# Altium project XBeeSXPro_Breakout.PrjPcb
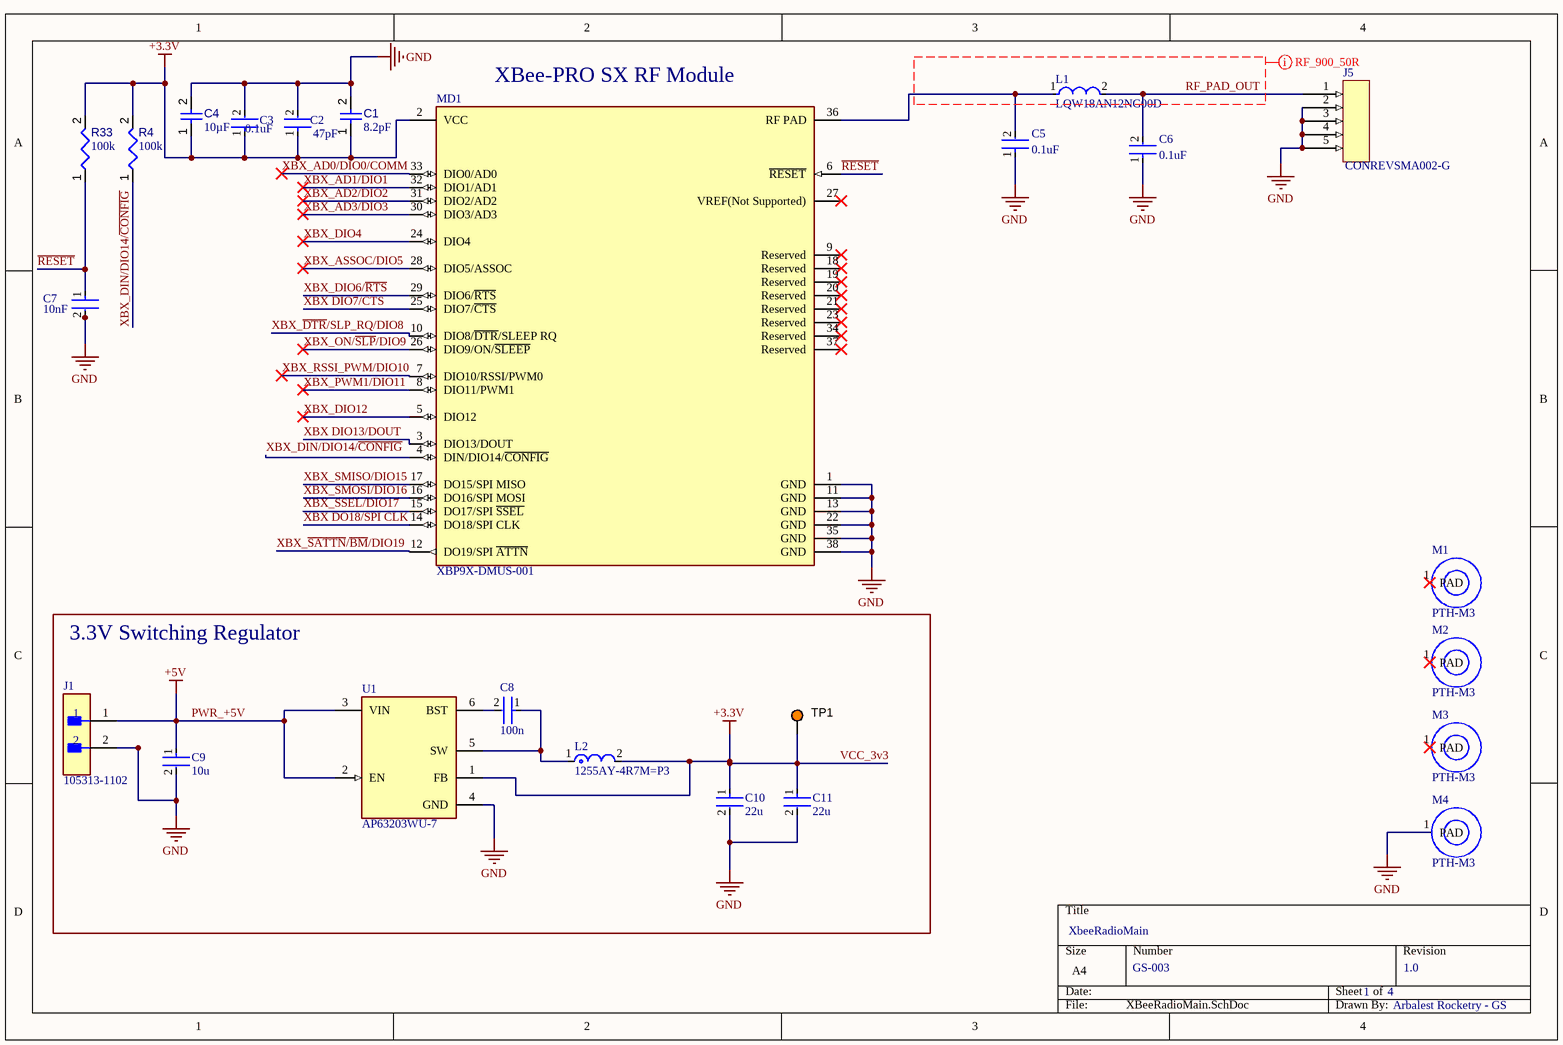
[diagram p0: XBeeRadioMain.SchDoc]
4 sheets, 102 parts. Net scope: global (net labels, ports and power ports of the same name join across sheets).
Board file: MainPCB_XBeeSXPro_Breakout.PcbDoc
Sheets:
  XBeeRadioMain.SchDoc
  FTDI_Chip.SchDoc
  Peripherals.SchDoc
  LED_Indicators.SchDoc

## Sheet XBeeRadioMain.SchDoc
size A4; SheetNumber: 1; SheetTotal: 4

### Parts
C1  value 8.2pF  [CAPC1608X06N]  (hidden comment: 600S8R2BT250XT4K)
C2  47pF  [FP-C0805C470JDGACTU-MFG]
C3  0.1uF  [FP-C0603C-CF-MFG]
C4  value 10µF  [CAPC0805(2012)145_L]  (hidden comment: Capacitor 10µF +/-20% 25V 0805)
C5  0.1uF  [FP-C0603C-CF-MFG]
C6  0.1uF  [FP-C0603C-CF-MFG]
C7  10nF  [FP-C0603C-CF-MFG]
C8  100n  [FP-0603-L_1_6_0_1-W_0_8_0-MFG]
C9  10u  [FP-GRM21B-0_2-e0_2_0_7-IPC_B]
C10  22u  [FP-1210-L_3_2_0_3-W_2_5_0-IPC_A]
C11  22u  [FP-1210-L_3_2_0_3-W_2_5_0-IPC_A]
J1  105313-1102  [FP-105313-1102-MFG]
J5  CONREVSMA002-G  [CONREVSMA002-G-Footprint-1]
L1  LQW18AN12NG00D  [FP-LQW18AN_00-MFG]
L2  1255AY-4R7M=P3  [FP-DG6045C-MFG]
M1  PTH-M3  [PTH-M3-Footprint-1]
M2  PTH-M3  [PTH-M3-Footprint-1]
M3  PTH-M3  [PTH-M3-Footprint-1]
M4  PTH-M3  [PTH-M3-Footprint-1]
MD1  XBP9X-DMUS-001  [FP-XBP9X-DMUS-001-MFG]
R4  value 100k  [RESC2013X70X40ML20T20]  (hidden comment: Resistor 100k +/-1% 0805 125 mW)
R33  value 100k  [RESC2013X70X40ML20T20]  (hidden comment: Resistor 100k +/-1% 0805 125 mW)
TP1  3V3  [KSTN-5003]  (value not drawn)
U1  AP63203WU-7  [FP-TSOT26-MFG]

### Blocks framed on the sheet
3.3V Switching Regulator: C8-C11 J1 L2 TP1 U1

### Nets
GND: C1.2 C2.2 C3.2 C4.2 C5.1 C6.1 C7.2 C9.2 C10.2 C11.2 J1.2 J5.2 J5.3 J5.4 J5.5 M4.1(PAD) MD1.1(GND) MD1.11(GND) MD1.13(GND) MD1.22(GND) MD1.35(GND) MD1.38(GND) U1.4(GND)
PWR_+5V: C9.1 J1.1 U1.2(EN) U1.3(VIN)  [also labelled +5V]
VCC_3v3: C1.1 C2.1 C3.1 C4.1 C10.1 C11.1 L2.2 MD1.2(VCC) R4.2 R33.2 TP1.1 U1.1(FB)  [also labelled +3.3V]
~{RESET}: C7.1 MD1.6(~{RESET}) R33.1
RF_PAD_OUT: C6.2 J5.1 L1.2
XBX DIO7/~{CTS}: MD1.25(DIO7/~{CTS})
XBX DIO13/DOUT: MD1.3(DIO13/DOUT)
XBX DO18/SPI CLK: MD1.14(DO18/SPI_CLK)
XBX_AD0/DIO0/COMM: MD1.33(DIO0/AD0)
XBX_AD1/DIO1: MD1.32(DIO1/AD1)
XBX_AD2/DIO2: MD1.31(DIO2/AD2)
XBX_AD3/DIO3: MD1.30(DIO3/AD3)
XBX_ASSOC/DIO5: MD1.28(DIO5/ASSOC)
XBX_~{DTR}/SLP_RQ/DIO8: MD1.10(DIO8/~{DTR}/SLEEP_RQ)
XBX_DIN/DIO14/~{CONFIG}: MD1.4(DIN/DIO14/~{CONFIG}) R4.1
XBX_DIO4: MD1.24(DIO4)
XBX_DIO6/~{RTS}: MD1.29(DIO6/~{RTS})
XBX_DIO12: MD1.5(DIO12)
XBX_ON/~{SLP}/DIO9: MD1.26(DIO9/ON/~{SLEEP})
XBX_PWM1/DIO11: MD1.8(DIO11/PWM1)
XBX_RSSI_PWM/DIO10: MD1.7(DIO10/RSSI/PWM0)
XBX_~{SATTN}/~{BM}/DIO19: MD1.12(DO19/SPI_~{ATTN})
XBX_~{SSEL}/DIO17: MD1.15(DO17/SPI_~{SSEL})
XBX_SMISO/DIO15: MD1.17(DO15/SPI_MISO)
XBX_SMOSI/DIO16: MD1.16(DO16/SPI_MOSI)
NetC5_2: C5.2 L1.1 MD1.36(RF_PAD)
NetC8_1: C8.1 L2.1 U1.5(SW)
NetC8_2: C8.2 U1.6(BST)

Not connected (* = marked no-connect by the designer): M1 1(PAD)*; M2 1(PAD)*; M3 1(PAD)*; MD1 9(Reserved)* 18(Reserved)* 19(Reserved)* 20(Reserved)* 21(Reserved)* 23(Reserved)* 27(VREF(Not_Supported))* 34(Reserved)* 37(Reserved)*

### Layout directives
net class RF_900_50R: RF_PAD_OUT

### Notes on the sheet
- (near MD1) XBee-PRO SX RF Module
- XbeeRadioMain
- GS-003
- 1
- 4
- 1.0
- Arbalest Rocketry - GS

### Library data of the parts
C1 = CMP-001-00086-1: Ceramic Capacitor, Multilayer, Ceramic, 250V, 1.22% +Tol, 1.22% -Tol, C0G, 30ppm/Cel TC, 0.0000082uF, Surface Mount,...; Max Operating Temperature: 125°C; Mounting Technology: Surface Mount; Min Operating Temperature: -55°C
C2 = CMP-2007-03325-2: CAP CER 47PF 1KV C0G/NP0 0805; Tolerance: 5%; Dissipation Factor: 0.1%; Dielectric: C0G; Voltage Rating (DC): 1.5kV; Dielectric Material: Ceramic; Lead Free: Lead Free; Case/Package: 0805; Construction: Flat; Thickness: 0.055inch; RoHS Compliant: Yes; Length: 0.079inch; Min Operating Temperature: -55°C; Max Operating Temperature: 125°C; Width: 0.049inch; Voltage Rating: 1kV; Radiation Hardening: No; Packaging: Tape and Reel; Termination: SMD/SMT; Series: C; Case Code (Metric): 2012; Mount: Surface Mount; Height: 1.25mm; Capacitance: 47pF; Case Code (Imperial): 0805; Package Quantity: 1; Depth: 1.2mm
C3 C5 C6 = CMP-2006-03061-2: CAP CER 0.1UF 50V X7R 0603; Manufacturer: KEMET; Manufacturer Part Number: C0603C104K5RACTU; Tolerance: 0.1; Temperature Coefficient: 30ppm/°C; Material: Ceramic; Automotive Grade: Grade 1; Value: 0.10 μF; Temperature: -55°C to +125°C; RoHS: TRUE; Temperature Range High: +125°C; Lead Free: Yes; Octopart: https://octopart.com/c0603c104k5ractu-kemet-139244; Digikey Description: CAP CER 0.1UF 50V X7R 0603; Category: Cap; Package: C0603C-CF; ComponentLink2Description: Datasheet; Temperature Range Low: -55°C; Device Class L1: Passive Components; Voltage Rating: 50 V; Automotive: Yes; Device Class L3: Ceramic Capacitors; ComponentLink2URL: https://api.kemet.com/component-edge/download/datasheet/C0603C100J5GACAUTO.pdf; Capacitance: 0.10 μF; Device Class L2: Capacitors; Temperature Characteristic: X7R; Height: 0.87mm
C4 = CMP-001-00079-4: Chip Capacitor, 10µF +/-20%, 25V, 0805, Thickness 1.45 mm; Tolerance: 10%; Max Operating Temperature: 85°C; Case/Package: 0805; Voltage Rating: 25V; Min Operating Temperature: -55°C; Mounting Technology: SMT; Pins: 2
C7 = CMP-2006-03046-3: CAP CER 10000PF 50V X7R 0603; Manufacturer: KEMET; Manufacturer Part Number: C0603C103K5RACTU; Temperature Coefficient: 30ppm/°C; Capacitance: 10,000 pF; Automotive Grade: Grade 1; Material: Ceramic; Value: 10,000 pF; Tolerance: 0.1; Voltage Rating: 50 V; Digikey Description: CAP CER 10000PF 50V X7R 0603; ComponentLink2Description: Datasheet; Mouser Description: Ceramic Capacitor 0.01Uf, 50V, X7R, 10%, 0603, Full Reel; ComponentLink2URL: https://api.kemet.com/component-edge/download/datasheet/C0603C100J5GACAUTO.pdf; Package: C0603C-CF; RoHS: TRUE; Octopart: https://octopart.com/c0603c103k5ractu-kemet-133094; Device Class L1: Passive Components; Temperature Range Low: -55°C; Automotive: Yes; Category: Cap; Lead Free: Yes; Temperature: -55°C to +125°C; Temperature Range High: +125°C; Temperature Characteristic: X7R; Height: 0.87mm; Device Class L3: Ceramic Capacitors; Device Class L2: Capacitors
C8 = CMP-14477-001538-2: None; Voltage Rating: 35V; Tolerance: 10%; Dielectric: X7R; Capacitance: 100nF; Case Code (Imperial): 0603; Case/Package: 0603; Packaging: Tape and Reel; Height: 0.8mm; Termination: SMD/SMT; Ratings: AEC-Q200; Min Operating Temperature: -55°C; Length: 0.063inch; Case Code (Metric): 1608; Lead Free: Lead Free; Halogen Free: Halogen Free; Mount: Surface Mount; Max Operating Temperature: 125°C; Width: 0.031inch; Voltage Rating (DC): 35V; Package Quantity: 1; Thickness: 0.035inch; RoHS Compliant: Yes
C9 = CMP-06035-047417-1: Chip Multilayer Ceramic Capacitors for General Purpose, 0805, 10uF, X7R, 15%, 10%, 25V
C10 C11 = CMP-14477-001688-2: None; Voltage Rating: 25V; Capacitance: 22uF; Tolerance: 20%; Mount: Surface Mount; Case Code (Metric): 3225; Min Operating Temperature: -55°C; Case Code (Imperial): 1210; Case/Package: 1210; Max Operating Temperature: 125°C; Packaging: Tape and Reel; RoHS Compliant: Yes
J1 = CMP-04776-000341-1: CONN HEADER R/A 2POS 2.5MM
J5 = CMP-002-00083-1: RF SMA Connector, Male, Board Mount, Solder Terminal; Manufacturer Lifecycle Status: ACTIVE; Impedance: 50Ω; Number of Positions: 1; China RoHS: Compliant; Packaging: Bulk; Contact Gender: Male
L1 = CMP-06042-001615-1: Wire Wound RF Inductor 12nH ±2% 600mA 0.13Ω 0603 (1608); Test Frequency: 100MHz; Series Resistance: 130mR; Self Resonant Frequency: 6GHz; Current: 500mA; Shielding: Unshielded; Q Factor: 35; Inductance: 12nH; Case Code (Metric): 1608; Case/Package: 0603; Max Operating Temperature: 125°C; Height: 0.8mm; Case Code (Imperial): 0603; Min Operating Temperature: -55°C; Radiation Hardening: No; Width: 0.8mm; Package Quantity: 4000; Number of Pins: 2; Tolerance: 2%; Lead Free: Lead Free; Termination: SMD/SMT; DC Resistance (DCR): 130mR; Packaging: Tape and Reel; Inductance Tolerance: 2%; Current Rating: 600mA; Weight: 0.000106oz; Length: 1.6mm; REACH SVHC: No SVHC; DC Current: 600mA; Depth: 1mm; Military Standard: Not; Max DC Current: 600mA; Resistor Type: Wirewound; Mount: Surface Mount
L2 = CMP-06042-012577-1: Shielded Wirewound Inductor 4.7uH 20% 4000mA 0.0276Ω SMD; Core Material: Ferrite; DC Resistance (DCR): 27.6mR; Test Frequency: 100kHz; Max DC Current: 4A; Current Rating: 4.5A; Packaging: Tape and Reel; Resistor Type: Wirewound; Tolerance: 20%; Height - Seated (Max): 0.177inch; Inductance: 4.7uH; Case/Package: Nonstandard; Shielding: Shielded; Length: 0.248inch; Width: 0.248inch; Mount: Surface Mount
M1-M4 = CMP-00028-00007-1: Mounting hole for M3 screw; Pins: 1; Case/Package: M3; Mounting Technology: THT
MD1 = CMP-84319-000001-1: XBEE PRO MOD TXRX ISM 915MHZ UFL; Manufacturer: Digi International; Min Supply Voltage: 2.4V; Max Supply Voltage: 3.6V; Number Of Adc Channels: 4; Interface: SPI,UART; Receiving Current: 40mA; Bandwidth: 26MHz; Max Frequency: 928MHz; Transmitting Current: 330-900mA; Data Rate: 250kbits/s; Sensitivity: -103dBm; Number Of Gpio: 20; Automotive: No; Lead Free: Yes; Package: 0; Height: 3.556mm; Temperature Range Low: -40°C; Temperature Range High: +85°C; Temperature: -40°C to +85°C; Device Class L1: Integrated Circuits (ICs); Category: UNK; Device Class L3: Transceivers; ComponentLink2URL: https://www.digi.com/resources/documentation/digidocs/pdfs/90001477.pdf; Digikey Description: XBEE PRO MOD TXRX ISM 915MHZ UFL; Octopart: https://octopart.com/xbp9x-dmus-001-digi+international-71530758; Device Class L2: RF Semiconductors and Devices; ComponentLink2Description: Datasheet; RoHS: TRUE; Manufacturer Part Number: XBP9X-DMUS-001
R4 R33 = CMP-009-00024-5: Chip Resistor, 100 KOhm, +/- 1%, 0.125 W, -55 to 155 degC, 0805 (2012 Metric); Power: 125mW; Voltage Rating: 150V; Max Operating Temperature: 155°C; Mounting Technology: SM; RoHS Compliant: True; Tolerance: 1%; Case/Package: 0805; Min Operating Temperature: -55°C; Pins: 2
TP1 = CMP-002-00037-2: Test Point, Orange, Height 4.6 mm, Tail Length 3 mm, 1-Pin THD, RoHS; Manufacturer: Keystone; Colour: Orange; Packaging: Bulk; Package Description: 1-Pin Through Hole Device, Dia 2.54 mm; Pins: 1; Package Reference: 5003; Datasheet Version: Jun-15; Case/Package: 5003; Mounting Technology: TH; Connector Type: TestPoint; Diameter: 2.54mm; Contact Material: Bronze; Datasheet URL: http://keyelco.com/userAssets/file/M65p56.pdf; Manufacturer URL: http://www.keyelco.com/; Package Quantity: 10; Contact Plating: Tin; RoHS Compliant: True
U1 = CMP-12757-000006-1: IC REG BUCK 3.3V 2A TSOT26; Manufacturer: Diodes Inc.; Output Type: Fixed; Min Supply Voltage: 3.8V; Number Of Outputs: 1; Max Junction Temp: +160°C; Nominal Supply Current: 22uA; Standoff Height: 0.01mm; Switching Frequency: 1.1MHz; Max Supply Voltage: 32V; ComponentLink2Description: Datasheet; Device Class L1: Integrated Circuits (ICs); Temperature: to +160°C; Device Class L3: Voltage Regulators - Switching; RoHS: TRUE; Octopart: https://octopart.com/ap63203wu-7-diodes+inc.-98099550; Output Voltage: 3.3V; Lead Free: Yes; ComponentLink2URL: https://www.diodes.com/assets/Datasheets/AP63200-AP63201-AP63203-AP63205.pdf; Digikey Description: IC REG BUCK 3.3V 2A TSOT26; Footprint Url: https://www.diodes.com/assets/Package-Files/TSOT26.pdf; Ambient Temperature Range High: +85°C; Height: 1mm; Automotive: No; Temperature Range High: +160°C; Switching Topology: Buck; Output Current: 2A; Package: TSOT26; Category: IC; Mouser Description: AP63203 Series 3.3 V 2 A SMT Fixed Low IQ Synchronous Buck - TSOT-26; Device Class L2: Power Management ICs; Ambient Temperature Range Low: -40°C; Manufacturer Part Number: AP63203WU-7

## Sheet FTDI_Chip.SchDoc
size A; SheetNumber: 2; SheetTotal: 4
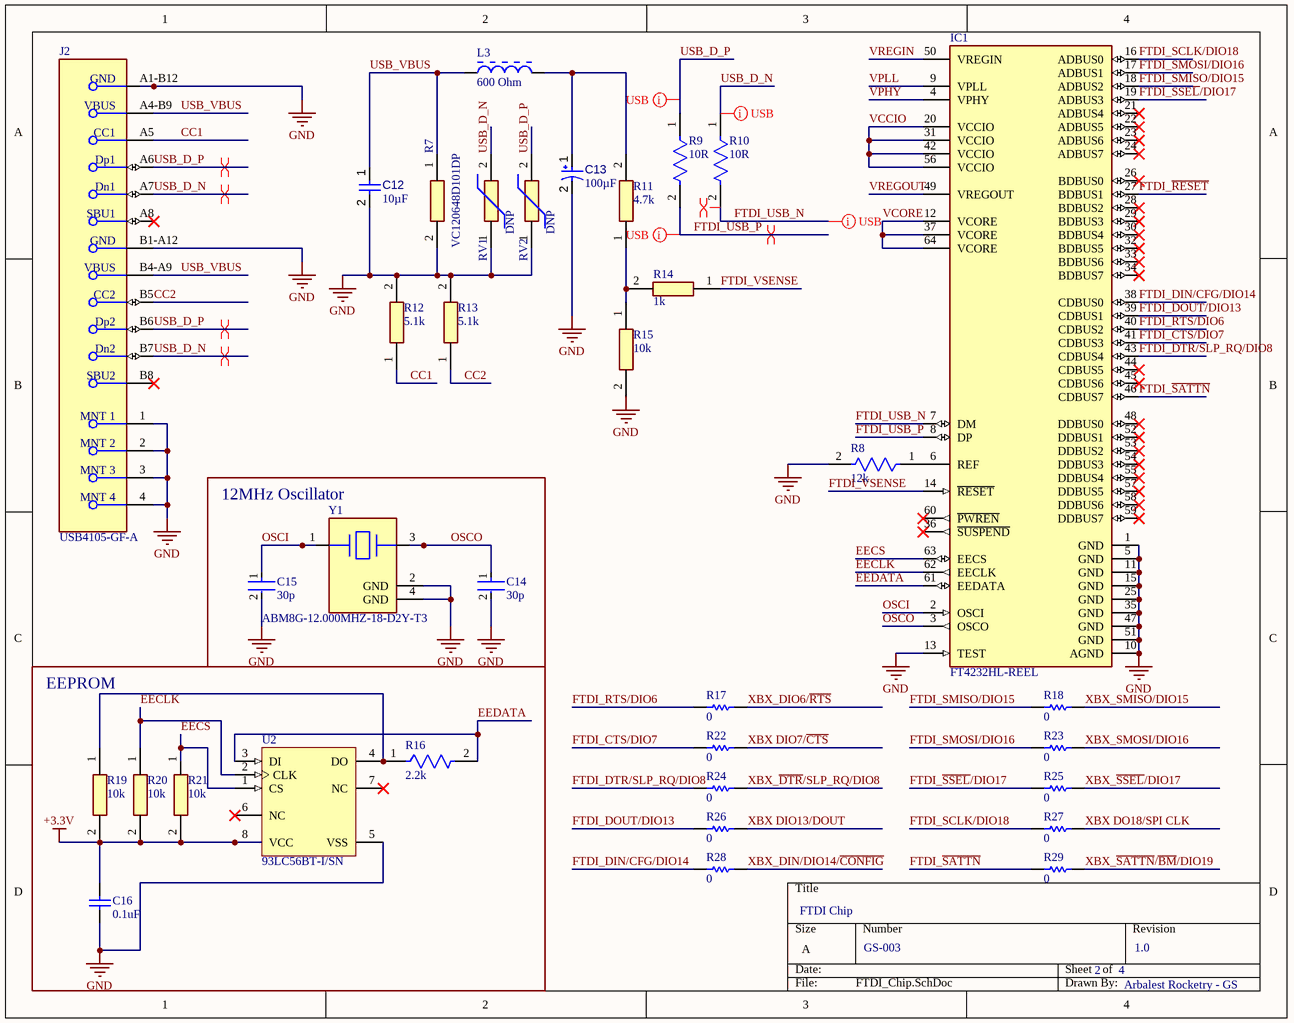
[diagram p1: FTDI_Chip.SchDoc]

### Parts
C12  value 10µF  [CAPC0805(2012)145_L]  (hidden comment: Capacitor 10µF +/-20% 25V 0805)
C13  value 100µF  [CAPPR65-350-1150X800X1250]  (hidden comment: ECA1HM101)
C14  30p  [FP-GCM188-0_1-IPC_B]
C15  30p  [FP-GCM188-0_1-IPC_B]
C16  0.1uF  [CAPC0603(1608)100_L]
IC1  FT4232HL-REEL  [FP-LQFP-64-MFG]
J2  USB4105-GF-A  [FP-USB4105-GF-A-MFG]
L3  600 Ohm  [LIRD-MI0805K601R-10-2_V]
R7  VC120648D101DP  [RESC3216X102N]
R8  12k  [FP-CRCW0402-e3-MFG]
R9  10R  [FP-CRCW0603-e3-MFG]
R10  10R  [FP-CRCW0603-e3-MFG]
R11  4.7k  [RESC1608X55N]
R12  5.1k  [RESC1608X55N]
R13  5.1k  [RESC1608X55N]
R14  1k  [RESC1608X55N]
R15  10k  [RESC1608X55N]
R16  2.2k  [FP-CRCW0603-Pe3-IPC_B]
R17  value 0  [RESC1608X55X25ML10T15]  (hidden comment: Resistor 0R +/- 5% 0603 100 mW)
R18  value 0  [RESC1608X55X25ML10T15]  (hidden comment: Resistor 0R +/- 5% 0603 100 mW)
R19  10k  [RESC1608X55N]
R20  10k  [RESC1608X55N]
R21  10k  [RESC1608X55N]
R22  value 0  [RESC1608X55X25ML10T15]  (hidden comment: Resistor 0R +/- 5% 0603 100 mW)
R23  value 0  [RESC1608X55X25ML10T15]  (hidden comment: Resistor 0R +/- 5% 0603 100 mW)
R24  value 0  [RESC1608X55X25ML10T15]  (hidden comment: Resistor 0R +/- 5% 0603 100 mW)
R25  value 0  [RESC1608X55X25ML10T15]  (hidden comment: Resistor 0R +/- 5% 0603 100 mW)
R26  value 0  [RESC1608X55X25ML10T15]  (hidden comment: Resistor 0R +/- 5% 0603 100 mW)
R27  value 0  [RESC1608X55X25ML10T15]  (hidden comment: Resistor 0R +/- 5% 0603 100 mW)
R28  value 0  [RESC1608X55X25ML10T15]  (hidden comment: Resistor 0R +/- 5% 0603 100 mW)
R29  value 0  [RESC1608X55X25ML10T15]  (hidden comment: Resistor 0R +/- 5% 0603 100 mW)
RV1  DNP  [VARC1608X90N]
RV2  DNP  [VARC1608X90N]
U2  93LC56BT-I/SN  [SOIC-SN8_N]
Y1  ABM8G-12.000MHZ-18-D2Y-T3  [FP-ABM8G-MFG]

### Blocks framed on the sheet
12MHz Oscillator: C14 C15 Y1
EEPROM: C16 R16 R19-R21 U2

### Nets
+3.3V: C16.2 IC1.20(VCCIO) IC1.31(VCCIO) IC1.42(VCCIO) IC1.50(VREGIN) IC1.56(VCCIO) R19.2 R20.2 R21.2 U2.8(VCC)  [also labelled VCCIO, VREGIN]  [project net VCC_3v3]
GND: C12.2 C13.2 C14.2 C15.2 C16.1 IC1.1(GND) IC1.5(GND) IC1.10(AGND) IC1.11(GND) IC1.13(TEST) IC1.15(GND) IC1.25(GND) IC1.35(GND) IC1.47(GND) IC1.51(GND) J2.1(MNT_1) J2.2(MNT_2) J2.3(MNT_3) J2.4(MNT_4) J2.A1-B12(GND) J2.B1-A12(GND) R7.2 R8.2 R12.2 R13.2 R15.2 RV1.1 RV2.1 U2.5(VSS) Y1.2(GND) Y1.4(GND)
CC1: J2.A5(CC1) R12.1
CC2: J2.B5(CC2) R13.1
EECLK: IC1.62(EECLK) R20.1 U2.2(CLK)
EECS: IC1.63(EECS) R21.1 U2.1(CS)
EEDATA: IC1.61(EEDATA) R16.2 U2.3(DI)
FTDI_CTS/DIO7: IC1.41(CDBUS3) R22.1
FTDI_DIN/CFG/DIO14: IC1.38(CDBUS0) R28.1
FTDI_DOUT/DIO13: IC1.39(CDBUS1) R26.1
FTDI_DTR/SLP_RQ/DIO8: IC1.43(CDBUS4) R24.1
FTDI_~{RESET}: IC1.27(BDBUS1)
FTDI_RTS/DIO6: IC1.40(CDBUS2) R17.1
FTDI_~{SATTN}: IC1.46(CDBUS7) R29.1
FTDI_~{SSEL}/DIO17: IC1.19(ADBUS3) R25.1
FTDI_SCLK/DIO18: IC1.16(ADBUS0) R27.1
FTDI_SMISO/DIO15: IC1.18(ADBUS2) R18.1
FTDI_SMOSI/DIO16: IC1.17(ADBUS1) R23.1
FTDI_USB_N: IC1.7(DM) R10.2
FTDI_USB_P: IC1.8(DP) R9.2
FTDI_VSENSE: IC1.14(~{RESET}) R14.1
OSCI: C15.1 IC1.2(OSCI) Y1.1
OSCO: C14.1 IC1.3(OSCO) Y1.3
USB_D_N: J2.A7(Dn1) J2.B7(Dn2) R10.1 RV1.2
USB_D_P: J2.A6(Dp1) J2.B6(Dp2) R9.1 RV2.2
USB_VBUS: C12.1 J2.A4-B9(VBUS) J2.B4-A9(VBUS) L3.1 R7.1
VCORE: IC1.12(VCORE) IC1.37(VCORE) IC1.49(VREGOUT) IC1.64(VCORE)  [also labelled VREGOUT]  [project net FTDI_1V8]
VPHY: IC1.4(VPHY)
VPLL: IC1.9(VPLL)
XBX DIO7/~{CTS}: R22.2
XBX DIO13/DOUT: R26.2
XBX DO18/SPI CLK: R27.2
XBX_~{DTR}/SLP_RQ/DIO8: R24.2
XBX_DIN/DIO14/~{CONFIG}: R28.2
XBX_DIO6/~{RTS}: R17.2
XBX_~{SATTN}/~{BM}/DIO19: R29.2
XBX_~{SSEL}/DIO17: R25.2
XBX_SMISO/DIO15: R18.2
XBX_SMOSI/DIO16: R23.2
NetC13_1: C13.1 L3.2 R11.2
NetIC1_6: IC1.6(REF) R8.1
NetR11_1: R11.1 R14.2 R15.1
NetR16_1: R16.1 R19.1 U2.4(DO)

Not connected (* = marked no-connect by the designer): IC1 21(ADBUS4)* 22(ADBUS5)* 23(ADBUS6)* 24(ADBUS7)* 26(BDBUS0)* 28(BDBUS2)* 29(BDBUS3)* 30(BDBUS4)* 32(BDBUS5)* 33(BDBUS6)* 34(BDBUS7)* 36(~{SUSPEND})* 44(CDBUS5)* 45(CDBUS6)* 48(DDBUS0)* 52(DDBUS1)* 53(DDBUS2)* 54(DDBUS3)* 55(DDBUS4)* 57(DDBUS5)* 58(DDBUS6)* 59(DDBUS7)* 60(~{PWREN})*; J2 A8(SBU1)* B8(SBU2)*; U2 6(NC)* 7(NC)*

### Layout directives
differential pair: FTDI_USB_N, FTDI_USB_P, USB_D_N, USB_D_P
net class USB: USB_D_N
mark named USB: FTDI_USB_N, FTDI_USB_P, USB_D_P

### Notes on the sheet
- FTDI Chip
- GS-003
- 2
- 4
- 1.0
- Arbalest Rocketry - GS

### Library data of the parts
C12 = CMP-001-00079-4: as C4 on sheet XBeeRadioMain; Max Operating Temperature: 85°C; Case/Package: 0805; Voltage Rating: 25V; Min Operating Temperature: -55°C; Mounting Technology: SMT; Pins: 2
C13 = CMP-001-00026-7: Aluminum Electrolytic Capacitor, 100 uF, +/- 20%, 50 V, -40 to 85 degC, 2-Pin THD, RoHS, Bulk; Manufacturer: Panasonic; Voltage Rating: 50V; Ripple Current: 250mA; Datasheet URL: https://industrial.panasonic.com/cdbs/www-data/pdf/RDF0000/ABA0000C1218.pdf; Lead Pitch: 3.5mm; Mounting Technology: TH; Package Description: 2-Pin Radial Lead, Dia 8 mm, Height 12.5 mm; Diameter: 8mm; Ripple Current (AC): 250mA; Manufacturer URL: http://www.panasonic.com/; Capacitor Type: Electrolytic; Max Operating Temperature: 85°C; Pins: 2; Min Operating Temperature: -40°C; Tolerance: 20%; Case/Package: Radial; Packaging: Bulk; Package Quantity: 200; Package Reference: CAPPR65-350-1150X800X1250; RoHS Compliant: True; Datasheet Version: Rev. 05, 10/2016
C14 C15 = CMP-06035-014609-1: Ceramic Capacitor for Automotive 30pF  ±1% 100VDC C0G 0603 Paper T/R
C16 = CMP-1035-02591-1: CAP 100nF 50V ±5% 0603 (1608 Metric) Thickness 1mm SMD; Tolerance: Â±5%; Case-Metric: 1608; Case-EIA: 0603; Rated Voltage: 50 V; Max Thickness: 1 mm; Technology: SMT; Value: 100nF
IC1 = CMP-0078-00021-4: IC USB HS QUAD UART/SYNC 64-LQFP; Manufacturer: FTDI; Number Of Ports: 1; Max Supply Voltage: 3.6V; Data Rate: 480Mbits/s; Nominal Supply Current: 70mA; Usb Standard: USB 2.0; Interface: I2C,SPI,UART,USB,Other; Min Supply Voltage: 3V; Standoff Height: 0.05mm; Ipc Land Pattern Name: QFP50P1200X1200X160-64; ComponentLink2Description: Datasheet; Temperature Range Low: -40°C; Footprint Url: https://www.ftdichip.com/Support/Documents/TechnicalNotes/TN_166%20FTDI%20Example%20IC%20PCB%20Footprints.pdf; Manufacturer Part Number: FT4232HL-REEL; Height: 1.6mm; ComponentLink2URL: https://www.ftdichip.com/Support/Documents/DataSheets/ICs/DS_FT4232H.pdf; Device Class L2: Interface ICs; Ambient Temperature Range Low: -40°C; RoHS: TRUE; Package: LQFP-64; Temperature Range High: +85°C; Digikey Description: IC USB HS QUAD UART/SYNC 64-LQFP; Temperature: -40°C to +85°C; Lead Free: Yes; Device Class L1: Integrated Circuits (ICs); Category: IC; Automotive: No; Ambient Temperature Range High: +85°C; Octopart: https://octopart.com/ft4232hl-reel-ftdi-19172127; Device Class L3: USB Interface ICs
J2 = CMP-245163-000001-1: CONN RCPT USB2.0 TYPEC 5A; Manufacturer: GCT; Voltage Rating: 20V; Is Female: yes; Current Rating: 5/6.25/1.25/0.25A; Number Of Contacts: 16; Conn Orientation: Right Angle; Device Class L1: Connectors; Category: Conn; Lead Free: Yes; RoHS: TRUE; Temperature Range High: +85°C; Digikey Description: CONN RCPT USB2.0 TYPEC 5A; Device Class L3: unset; ComponentLink2Description: Datasheet; Manufacturer Part Number: USB4105-GF-A; Package: 0; Usb Standard: USB 2.0; Device Class L2: USB Connectors; Automotive: No; Temperature Range Low: -40°C; Height: 3.46mm; Temperature: -40°C to +85°C; Contact Material: Gold,Nickel; ComponentLink2URL: https://gct.co/files/drawings/usb4105.pdf; Octopart: https://octopart.com/usb4105-gf-a-gct-106627878
L3 = CMP-2000-05196-1: Chip Bead for Power Filtering, 1500 mA, 600 Ohm, -40 to 125 degC, 0805 (2012 Metric), RoHS, Tape and Reel; Manufacturer: Laird; Filter Type: PowerLine; Current Rating (Max): 1.5A; Catalog Drawings: (HI,HZ,LI,MI)0805Series_1.10mmMax.Height; Impedance @ Frequency: 600Ohm@100MHz; Number of Lines: 1; DC Resistance (DCR) (Max): 100mOhm; Other Names: 240-2390-1; Kits: 240-2227-ND-KITEMIFERRITEBEADCHIPSMD; Online Catalog: MISeries; Standard Package: 1; Datasheet Version: Rev. A, 01/2004; Height (Max): 0.043"(1.10mm); Category: Filters; Operating Temperature: -40degC~125degC; Package Description: 2-Pin Surface Mount Device, Body 2 x 1.25 mm; Package / Case: 0805(2012Metric); Package Reference: MI0805K601R-10-2; Packaging: CutTape(CT); Ratings: -; Mounting Type: SurfaceMount; Datasheet URL: https://datasheet.ciiva.com/3082/mi0805k601r-10-a-vp-3082219.pdf; Size / Dimension: 0.079"Lx0.049"W(2.00mmx1.25mm); Family: FerriteBeadsandChips; Manufacturer URL: https://www.lairdtech.com; Series: MI
R7 = VC120648D101DP: Varistor; Manufacturer_Name: Kyocera AVX; Datasheet Link: https://componentsearchengine.com/Datasheets/2/VC120648D101DP.pdf; Height: 1.02mm; Manufacturer_Part_Number: VC120648D101DP; Mouser Part Number: 581-VC120648D101DP; Mouser Price/Stock: https://www.mouser.com/Search/Refine.aspx?Keyword=581-VC120648D101DP; Arrow Part Number: VC120648D101DP; Arrow Price/Stock: https://www.arrow.com/en/products/vc120648d101dp/avx?region=europe
R8 = CMP-02407-010136-1: RES Thick Film, 12kΩ, 1%, 0.063W, 100ppm/°C, 0402; Max Power Dissipation: 63mW; Resistance: 12kR; Max Operating Temperature: 155°C; Temperature Coefficient: 100ppm/°C; Composition: Thick Film; Packaging: Tape and Reel; Min Operating Temperature: -55°C; Length: 0.039inch; Height: 0.016inch; Number of Terminations: 2; Features: Automotive AEC-Q200; Lead Free: Lead Free; Package Quantity: 50000; Case/Package: 0402; Tolerance: 1%; Width: 0.02inch
R9 R10 = CMP-02407-006896-1: RES Thick Film, 10Ω, 1%, 0.1W, 100ppm/°C, 0603; Power Rating: 100mW; Lead Free: Lead Free; Case/Package: 0603; Tolerance: 1%; Resistance: 10R
R11 = CR0603-JW-472ELF: Resistor; Manufacturer_Name: Bourns; Datasheet Link: https://www.bourns.com/pdfs/chpreztr.pdf; Height: 0.55mm; Manufacturer_Part_Number: CR0603-JW-472ELF; Mouser Part Number: 652-CR0603-JW-472ELF; Mouser Price/Stock: https://www.mouser.co.uk/ProductDetail/Bourns/CR0603-JW-472ELF?qs=YYkh393lUtir45oxsbM4ug%3D%3D; Arrow Part Number: CR0603-JW-472ELF; Arrow Price/Stock: https://www.arrow.com/en/products/cr0603-jw-472elf/bourns?region=nac
R12 R13 = CR0603-FX-5101ELF: Resistor; Manufacturer_Name: Bourns; Datasheet Link: https://www.bourns.com/pdfs/chpreztr.pdf; Height: 0.55mm; Manufacturer_Part_Number: CR0603-FX-5101ELF; Mouser Part Number: 652-CR0603FX-5101ELF; Mouser Price/Stock: https://www.mouser.co.uk/ProductDetail/Bourns/CR0603-FX-5101ELF?qs=0nF2VnfAjXkzZl7D0jRjmQ%3D%3D; Arrow Part Number: CR0603-FX-5101ELF; Arrow Price/Stock: https://www.arrow.com/en/products/cr0603-fx-5101elf/bourns?utm_currency=USD&region=nac
R14 = CR0603-JW-102ELF: Resistor; Manufacturer_Name: Bourns; Datasheet Link: https://www.bourns.com/pdfs/chpreztr.pdf; Height: 0.55mm; Manufacturer_Part_Number: CR0603-JW-102ELF; Mouser Part Number: 652-CR0603-JW-102ELF; Mouser Price/Stock: https://www.mouser.co.uk/ProductDetail/Bourns/CR0603-JW-102ELF?qs=rcPhh2wube3o3zlmFZCUPg%3D%3D; Arrow Part Number: CR0603-JW-102ELF; Arrow Price/Stock: https://www.arrow.com/en/products/cr0603-jw-102elf/bourns?region=nac
R15 R19-R21 = CR0603-FX-1002ELF: Resistor; Manufacturer_Name: Bourns; Datasheet Link: https://www.bourns.com/pdfs/chpreztr.pdf; Height: 0.55mm; Manufacturer_Part_Number: CR0603-FX-1002ELF; Mouser Part Number: 652-CR0603FX-1002ELF; Mouser Price/Stock: https://www.mouser.co.uk/ProductDetail/Bourns/CR0603-FX-1002ELF?qs=K5ddiUFZPT6XHG0dQH96QA%3D%3D; Arrow Part Number: CR0603-FX-1002ELF; Arrow Price/Stock: https://www.arrow.com/en/products/cr0603-fx-1002elf/bourns?utm_currency=USD&region=europe
R16 = CMP-03613-000087-1: RES Thick Film, 2.2kΩ, 1%, 0.1W, 50ppm/°C, 0603; Resistance: 2.2kR; Max Power Dissipation: 100mW; Package Quantity: 5000; Military Standard: Not; Min Operating Temperature: -55°C; Tolerance: 1%; Number of Terminations: 2; Features: Automotive AEC-Q200; Temperature Coefficient: 50ppm/°C; Max Operating Temperature: 155°C; RoHS Compliant: Yes; Height: 0.02inch; Case/Package: 0603; Width: 0.033inch; Series: CRCW-P; Depth: 0.85mm; Resistor Type: Thick Film; Length: 0.061inch; Packaging: Tape and Reel
R17 R18 R22-R29 = CMP-009-00006-5: Chip Resistor, 0 Ohm, 0.1 W, -55 to 155 degC, 0603 (1608 Metric); Power: 100mW; Voltage Rating: 50V; Max Operating Temperature: 155°C; RoHS Compliant: True; Mounting Technology: SM; Case/Package: 0603; Min Operating Temperature: -55°C; Tolerance: 5%; Pins: 2
RV1 RV2 = USB0001DP: Varistor; Manufacturer_Name: Kyocera AVX; Datasheet Link: https://mouser.componentsearchengine.com/Datasheets/1/USB0001DP.pdf; Height: 0.9mm; Manufacturer_Part_Number: USB0001DP; Mouser Part Number: 581-USB0001DP; Mouser Price/Stock: https://www.mouser.co.uk/ProductDetail/KYOCERA-AVX/USB0001DP?qs=uJhfjP5Xp6wpAsZ0ctZLuw%3D%3D; Arrow Part Number: USB0001DP; Arrow Price/Stock: https://www.arrow.com/en/products/usb0001dp/avx?utm_currency=USD&region=nac
U2 = CMP-0162-00090-1: 2K, 128x16-bit, 2.5V Microwire Serial EEPROM, 8-Pin SOIC 150mil, Industrial Temperature, Tape and Reel; PackageDescription: 8-Lead Plastic Small Outline (SN) - Narrow, 3.90mm Body [SOIC]; DatasheetVersion: revF, May-2008; Code_IPC: SOIC127P600-8; Code_JEDEC: MS-012; PackageVersion: revBB, Aug-2009; PackageReference: SOIC-SN8
Y1 = CMP-27762-015318-1: Crystal 12MHz ±20ppm (Tol) ±30ppm (Stability) 18pF FUND 120Ω 4-Pin SMD T/R; Series Resistance: 120R; Load Capacitance: 18pF; Mount: Surface Mount; Length: 0.126inch; Package Quantity: 3000; Termination: SMD/SMT; Width: 2.5mm; Max Operating Temperature: 85°C; ESR (Equivalent Series Resistance): 120R; Packaging: Tape and Reel; Operating Frequency: 12 MHz; Frequency Tolerance: 20ppm; Frequency: 12MHz; Lead Free: Lead Free; Case/Package: SMD/SMT; Height: 0.039inch; Tolerance: 20ppm; Series: ABM8G; Frequency Stability: 30ppm; Min Operating Temperature: -40°C; Number of Pins: 4

## Sheet Peripherals.SchDoc
size A; SheetNumber: 3; SheetTotal: 4
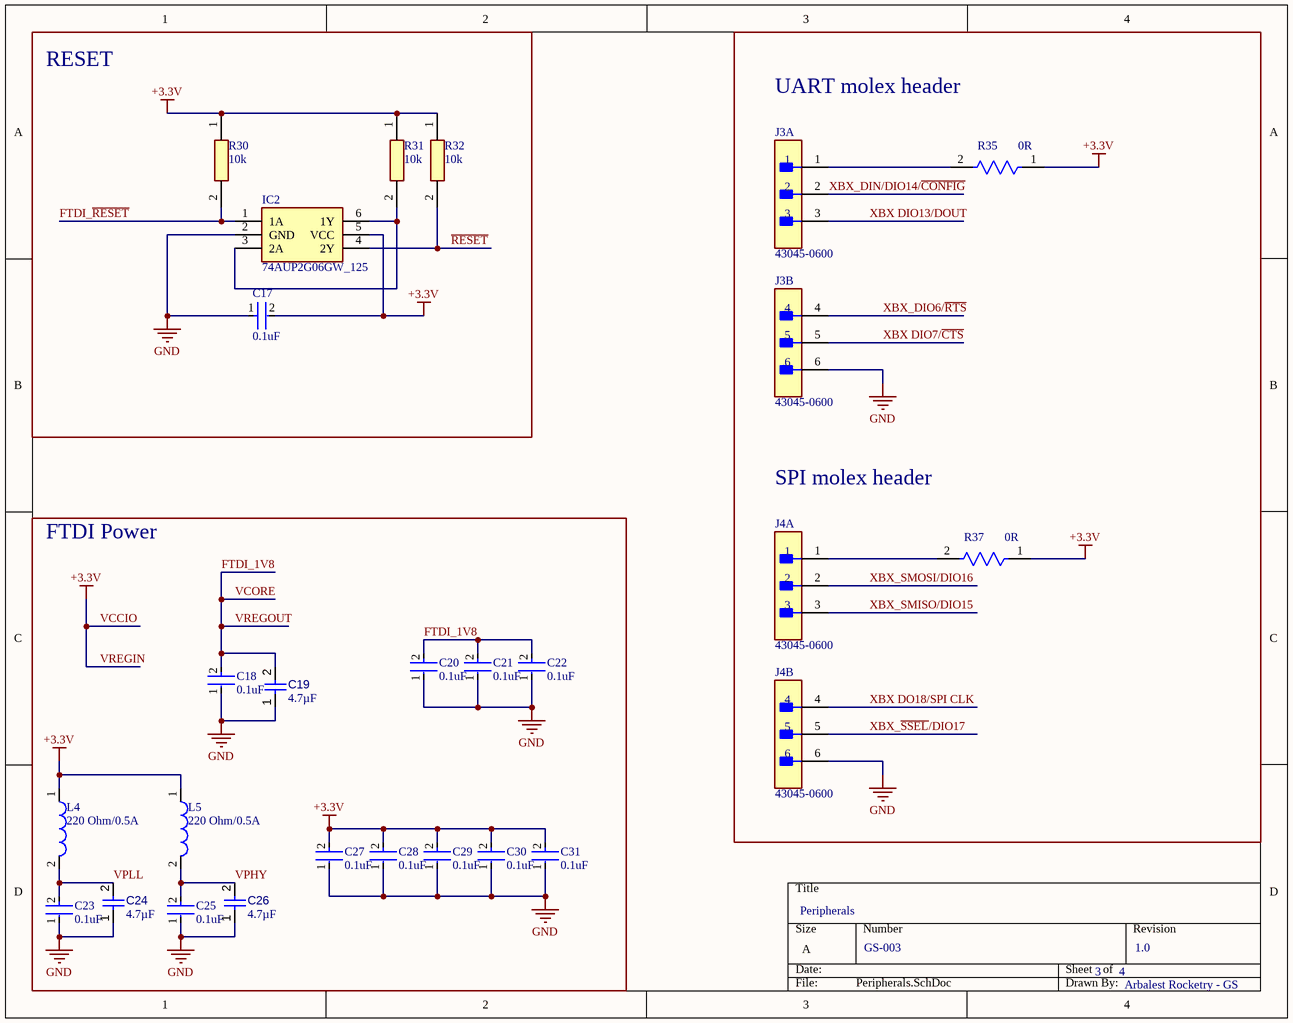
[diagram p2: Peripherals.SchDoc]

### Parts
C17  0.1uF  [FP-CGA3E-0_3-0_1-IPC_A]
C18  0.1uF  [FP-GCJ188-0_2-IPC_C]
C19  value 4.7µF  [CAPC0603(1608)100_L]  (hidden comment: Capacitor 4.7µF +/-20% 10V 0603)
C20  0.1uF  [FP-GCJ188-0_2-IPC_C]
C21  0.1uF  [FP-GCJ188-0_2-IPC_C]
C22  0.1uF  [FP-GCJ188-0_2-IPC_C]
C23  0.1uF  [FP-GCJ188-0_2-IPC_C]
C24  value 4.7µF  [CAPC0603(1608)100_L]  (hidden comment: Capacitor 4.7µF +/-20% 10V 0603)
C25  0.1uF  [FP-GCJ188-0_2-IPC_C]
C26  value 4.7µF  [CAPC0603(1608)100_L]  (hidden comment: Capacitor 4.7µF +/-20% 10V 0603)
C27  0.1uF  [FP-GCJ188-0_2-IPC_C]
C28  0.1uF  [FP-GCJ188-0_2-IPC_C]
C29  0.1uF  [FP-GCJ188-0_2-IPC_C]
C30  0.1uF  [FP-GCJ188-0_2-IPC_C]
C31  0.1uF  [FP-GCJ188-0_2-IPC_C]
IC2  74AUP2G06GW_125  [SOT65P210X110-6N]
J3  43045-0600  [FP-0430450600-MFG]  (parts A,B of 2)
J4  43045-0600  [FP-0430450600-MFG]  (parts A,B of 2)
L4  220 Ohm/0.5A  [SMD-0603]
L5  220 Ohm/0.5A  [SMD-0603]
R30  10k  [RESC1608X55N]
R31  10k  [RESC1608X55N]
R32  10k  [RESC1608X55N]
R35  0R  [FP-ERJ-3GEY0R00V-MFG]
R37  0R  [FP-ERJ-3GEY0R00V-MFG]

### Blocks framed on the sheet
RESET: C17 IC2 R30-R32
FTDI Power: C18-C31 L4 L5

### Nets
+3.3V: C17.2 C27.2 C28.2 C29.2 C30.2 C31.2 IC2.5(VCC) L4.1 L5.1 R30.1 R31.1 R32.1 R35.1 R37.1  [also labelled VCCIO, VREGIN]  [project net VCC_3v3]
GND: C17.1 C18.1 C19.1 C20.1 C21.1 C22.1 C23.1 C24.1 C25.1 C26.1 C27.1 C28.1 C29.1 C30.1 C31.1 IC2.2(GND) J3.6 J4.6
FTDI_1V8: C18.2 C19.2 C20.2 C21.2 C22.2  [also labelled VCORE, VREGOUT]
FTDI_~{RESET}: IC2.1(1A) R30.2
~{RESET}: IC2.4(2Y) R32.2
VPHY: C25.2 C26.2 L5.2
VPLL: C23.2 C24.2 L4.2
XBX DIO7/~{CTS}: J3.5
XBX DIO13/DOUT: J3.3
XBX DO18/SPI CLK: J4.4
XBX_DIN/DIO14/~{CONFIG}: J3.2
XBX_DIO6/~{RTS}: J3.4
XBX_~{SSEL}/DIO17: J4.5
XBX_SMISO/DIO15: J4.3
XBX_SMOSI/DIO16: J4.2
NetIC2_3: IC2.3(2A) IC2.6(1Y) R31.2
NetJ3_1: J3.1 R35.2
NetJ4_1: J4.1 R37.2

### Notes on the sheet
- UART molex header
- SPI molex header
- Peripherals
- GS-003
- 3
- 4
- 1.0
- Arbalest Rocketry - GS

### Library data of the parts
C17 = CMP-08246-001708-1: Cap Ceramic 100nF 50V X7R 20% Pad SMD 0603 +125°C Automotive T/R; Voltage Rating: 50V; Width: 0.031inch; Height: 0.8mm; Capacitance: 100nF; Case Code (Metric): 1608; Packaging: Tape and Reel; Mount: Surface Mount; Weight: 7.1E-05oz; Max Operating Temperature: 125°C; Min Operating Temperature: -55°C; Voltage Rating (DC): 50V; Ratings: AEC-Q200; Dielectric: X7R; Case Code (Imperial): 0603; Package Quantity: 4000; Length: 0.063inch; Tolerance: 20%; Thickness: 0.031inch; Case/Package: 0603
C18 C20-C23 C25 C27-C31 = CMP-06035-054388-1: Cap Ceramic 0.1uF 50V X8R 10% Pad SMD 0603 Soft Termination +150°C Automotive T/R
C19 C24 C26 = CMP-001-00076-4: Chip Capacitor, 4.7µF +/-20%, 10V, 0603, Thickness 1 mm; Tolerance: 10%; Mounting Technology: SMT; Case/Package: 0603; Pins: 2; Min Operating Temperature: -55°C; Max Operating Temperature: 85°C; Voltage Rating: 10V
IC2 = CMP-159-000000-1: 74AUP2G06 - Low-power dual inverter with open-drain output@en-us; Manufacturer_Name: Nexperia; Manufacturer_Part_Number: 74AUP2G06GW,125; Geometry.Height: 1.1mm; Source: 74AUP2G06GW_125.SchLib; Mouser Part Number: 771-74AUP2G06GW125; Mouser Price/Stock: https://www.mouser.co.uk/ProductDetail/Nexperia/74AUP2G06GW125?qs=jquClx72t9AZXxLJ%252BWUccA%3D%3D; Arrow Part Number: *; Datasheet Link: https://assets.nexperia.com/documents/data-sheet/74AUP2G06.pdf; Arrow Price/Stock: *; Design Item ID: 74AUP2G06GW_125
J3 J4 = CMP-00257-00287064-1: 43045-0600 Connector Wire to Board Header 6 Position 3mm Solder Right Angle Thru-Hole Tray; NexarPartId: 287064; Manufacturer Lifecycle Status: ACTIVE; Max Current Rating: 5A; Voltage Rating (AC): 250V; Number of Positions: 6; Insulation Resistance: 1GΩ; Glow Wire Compliant: Compliant; Approvals: CSA, TUV, UL; Max Voltage Rating (DC): 250.25kV; Contact Resistance: 10mΩ; Plating: Tin; Gender: Male; Radiation Hardening: No; Number of Rows: 2; Lifecycle Status: Production; Row Spacing: 3mm; Orientation: Right Angle, Vertical; Housing Material: Thermoplastic; Diameter: 3mm; Termination: Solder; Height: 7.37mm; Min Operating Temperature: -40°C; Max Operating Temperature: 105°C; Depth: 12.2mm; Pitch: 3mm; Length: 12.6mm; Current Rating: 5A; Lead Free: Lead Free; Voltage Rating: 250V; Housing Color: Black; Mount: Through Hole; Number of Circuits: 6; Contact Plating: Tin; Country of Origin: US; Flammability Rating: UL94 V-0; RoHS: Compliant; Contact Material: Brass, Tin; Color: Black; Width: 9.9mm; Voltage Rating (DC): 250V; Lead Pitch: 3mm; Case/Package: SMC; REACH SVHC: No SVHC; Schedule B: 8536694040; Packaging: Bulk; Number of Pins: 6; Halogen Free: Low Halogen; Number of Contacts: 6; Material: Polyester
L4 L5 = CMP-0220-00148-1: SMD EMI Suppression Ferrite Bead WE-CBF, Z = 220 Ohm; Impedance: 220 Ohm; PackageVersion: 2009; ComponentLink2URL: http://www.we-online.de/katalog/media/pdf/74279263.pdf; PackageDescription: Chip Inductor, 2-Leads, Body 1.6 x 0.8 mm; PackageReference: SMD-0603; ComponentLink1URL: http://www.we-online.com; ComponentLink2Description: Datasheet; ComponentLink1Description: Manufacturer Link; DatasheetVersion: Dec-2005
R30-R32 = CR0603-FX-1002ELF: Resistor; Manufacturer_Name: Bourns; Datasheet Link: https://www.bourns.com/pdfs/chpreztr.pdf; Height: 0.55mm; Manufacturer_Part_Number: CR0603-FX-1002ELF; Mouser Part Number: 652-CR0603FX-1002ELF; Mouser Price/Stock: https://www.mouser.co.uk/ProductDetail/Bourns/CR0603-FX-1002ELF?qs=K5ddiUFZPT6XHG0dQH96QA%3D%3D; Arrow Part Number: CR0603-FX-1002ELF; Arrow Price/Stock: https://www.arrow.com/en/products/cr0603-fx-1002elf/bourns?utm_currency=USD&region=europe
R35 R37 = CMP-2000-00700-2: RES SMD 0 OHM JUMPER 1/10W 0603; Manufacturer Part Number: ERJ-3GEY0R00V; Manufacturer: Panasonic; Tolerance: 5%; Automotive Grade: Grade 0; Voltage Rating: 75V; Value: 0Ω; Temperature Coefficient: -100/+600ppm/°C; Power Rating: 0.1W; Mouser Description: Resistor, Chip Thick Film, 0 Ohm, 0.1w, Resistor, Chip Thick Film, 0 Ohm, 0.1w, 5%; Ipc Land Pattern Name: RESC16080X45; Category: Res; Package: 0603; Temperature: -55°C to +155°C; Temperature Range Low: -55°C; Series: ERJ; Resistance: 0Ω; RoHS: TRUE; Composition: Thick Film; Octopart: https://octopart.com/erj-3gey0r00v-panasonic-55389238; Device Class L1: Passive Components; Footprint Url: https://industrial.panasonic.com/cdbs/www-data/pdf/RDA0000/DMA0000COL17.pdf; ComponentLink2Description: Datasheet; Device Class L2: Resistors; Temperature Range High: +155°C; Digikey Description: RES SMD 0 OHM JUMPER 1/10W 0603; Lead Free: Yes; Device Class L3: Chip SMD Resistors; Height: 0.55mm; ComponentLink2URL: https://industrial.panasonic.com/cdbs/www-data/pdf/RDA0000/AOA0000C301.pdf; Automotive: Yes

## Sheet LED_Indicators.SchDoc
size A; SheetNumber: 4; SheetTotal: 4
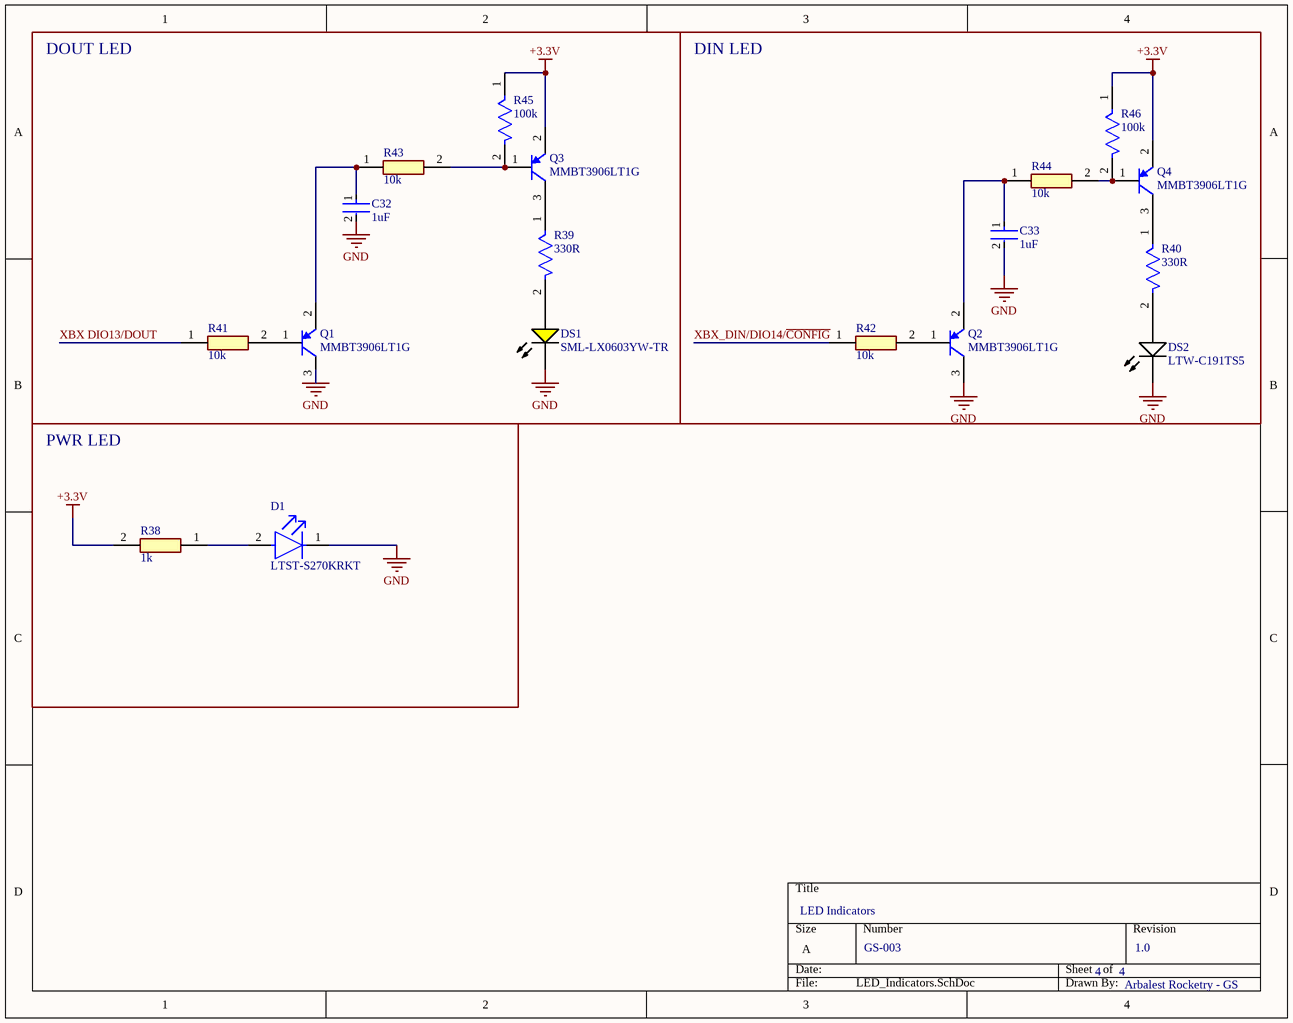
[diagram p3: LED_Indicators.SchDoc]

### Parts
C32  1uF  [FP-0603-L_1_6_0_1-W_0_8_0-IPC_A]
C33  1uF  [FP-0603-L_1_6_0_1-W_0_8_0-IPC_A]
D1  LTST-S270KRKT  [FP-LTST-S270KRKT-MFG]
DS1  SML-LX0603YW-TR  [LUMX-SML-LX0603_V]
DS2  LTW-C191TS5  [LTST-LTW-C191TS5_V]
Q1  MMBT3906LT1G  [ONSC-SOT-23-3-318-08_V]
Q2  MMBT3906LT1G  [ONSC-SOT-23-3-318-08_V]
Q3  MMBT3906LT1G  [ONSC-SOT-23-3-318-08_V]
Q4  MMBT3906LT1G  [ONSC-SOT-23-3-318-08_V]
R38  1k  [RESC1608X55N]
R39  330R  [FP-RMCF0603-MFG]
R40  330R  [FP-RMCF0603-MFG]
R41  10k  [RESC1608X55N]
R42  10k  [RESC1608X55N]
R43  10k  [RESC1608X55N]
R44  10k  [RESC1608X55N]
R45  100k  [FP-MCT0603-IPC_A]
R46  100k  [FP-MCT0603-IPC_A]

### Blocks framed on the sheet
DOUT LED: C32 DS1 Q1 Q3 R39 R41 R43 R45
DIN LED: C33 DS2 Q2 Q4 R40 R42 R44 R46
PWR LED: D1 R38

### Nets
+3.3V: Q3.2(E) Q4.2(E) R38.2 R45.1 R46.1  [project net VCC_3v3]
GND: C32.2 C33.2 D1.1(C) DS1.2(K) DS2.2(K) Q1.3(C) Q2.3(C)
XBX DIO13/DOUT: R41.1
XBX_DIN/DIO14/~{CONFIG}: R42.1
NetC32_1: C32.1 Q1.2(E) R43.1
NetC33_1: C33.1 Q2.2(E) R44.1
NetD1_2: D1.2(A) R38.1
NetDS1_1: DS1.1(A) R39.2
NetDS2_1: DS2.1(A) R40.2
NetQ1_1: Q1.1(B) R41.2
NetQ2_1: Q2.1(B) R42.2
NetQ3_1: Q3.1(B) R43.2 R45.2
NetQ3_3: Q3.3(C) R39.1
NetQ4_1: Q4.1(B) R44.2 R46.2
NetQ4_3: Q4.3(C) R40.1

### Notes on the sheet
- LED Indicators
- GS-003
- 4
- 1.0
- Arbalest Rocketry - GS

### Library data of the parts
C32 C33 = CMP-2000-07259-3: None; Voltage Rating (DC): 25V; Dielectric: X7R; Tolerance: 10%; Height: 0.8mm; Case Code (Metric): 1608; Max Operating Temperature: 125°C; Case Code (Imperial): 0603; Case/Package: 0603; Resistor Type: Ceramic; Halogen Free: Halogen Free; Capacitance: 1uF; Series: M; Voltage Rating: 25V; Number of Pins: 2; Depth: 0.8mm; RoHS Compliant: Yes; Mount: Surface Mount; Min Operating Temperature: -55°C; Length: 1.6mm; Contact Plating: Tin; Radiation Hardening: No; Width: 0.031inch; Construction: Flat; Thickness: 0.035inch; Packaging: Tape and Reel; Termination: SMD/SMT; REACH SVHC: No SVHC; Package Quantity: 1
D1 = CMP-2000-06630-2: LED RED CLEAR CHIP SMD R/A; Test Current: 20mA; Number of LEDs: 1; Power Rating: 75mW; Lens Style: Diffused; Luminous Intensity: 54mcd; Wavelength: 639nm; Dominant Wavelength: 631nm; Lens Color: Colorless; Forward Voltage: 2V; Viewing Angle: 130°; Forward Current: 30mA; Reverse Voltage: 5V; Illumination Color: Red; Case Code (Imperial): 0603; Color: Red; Packaging: Tape and Reel; Number of Pins: 2; Length: 1.6mm; Lens Transparency: Clear; Width: 1.15mm; Power Dissipation: 75mW; Lead Free: Lead Free; Max Power Dissipation: 75mW; Case/Package: 0603; Max Operating Temperature: 85°C; Mount: Surface Mount; Depth: 0.6mm; Number of Elements: 1; Radiation Hardening: No; Case Code (Metric): 1608; Package Quantity: 1; Height: 0.6mm; Min Operating Temperature: -55°C
DS1 = CMP-2000-07121-1: Yellow LED, Milky White Diffused Lens, 2.1 V, 14 mcd, -25 to 85 degC, 2-Pin SMD, RoHS, Tape and Reel; Manufacturer: Lumex; COO: CN; Number of LEDs: 1; Type: Uni-Color; Intensity: 14mcd; Reverse Voltage: 5(Min)V; LED Material: GaAsP; Viewing Angle: 160; Peak Wavelength: 585nm; Pin_Count: 2; Lens Appearance: ColorlessDiffused; Operating Temperature: -25to85C; Color: Yellow; Mounting Technology: SurfaceMount; Package Description: 2-Pin Surface Mount Device, Body 1.6 x 0.8 mm; Mounting: SurfaceMount; Packaging: TapeandReel; RoHS: Unknown; Supplier_Package: SMD; Package Reference: SML-LX00603; Part No: SML-LX0603YW-TR; Datasheet URL: http://www.lumex.com/content/files/ProductAttachment/SML-LX0603YW-TR.pdf; Dimension: 1.6x0.8x0.6mm; Manufacturer URL: http://www.lumexinstruments.com/; HTS: 8541402000; Datasheet Version: Rev. G, 09/2013; Lens Dimensions: 1x0.8x0.3mm; Dominant Wavelength: N/A; ECCN: EARII; Supplier: Lumex; Family: SML-LX0603YW
DS2 = CMP-1674-00013-1: LED Uni-Color White, 70 mW, 20 mA, -20 to 80 degC, 2-Pin SMD, RoHS, Tape and Reel; Case\Package: 0603; Power Rating: 100 mW; Voltage Rating: 50 V; Tolerance: 1%; Resistance: 12 Ohm; Min Operating Temperature: -55 degC; Mount: Surface Mount; Pins: 2; Case Code (Imperial): 0603; PackageReference: LTW-C191TS5; ComponentLink2URL: http://optoelectronics.liteon.com/upload/download/DS22-2004-201/S_110_LTW-C191TS5.pdf; REACH SVHC: No SVHC; Max Operating Temperature: 155 degC; DatasheetVersion: Rev. B, 06/2010; Packaging: Tape and Reel; RoHSCompliant: true; Height: 0.45 mm; Length: 1.6 mm; Width: 0.8 mm; Voltage Rating (DC): 50 V; ComponentLink1URL: http://www.us.liteon.com/; PackageDescription: 2-Pin Surface Mount Device, Body 1.6 x 0.8 mm; ComponentLink1Description: Manufacturer URL; Case Code (Metric): 1608; Package Quantity: 5000; ComponentLink2Description: Datasheet
Q1-Q4 = CMP-1048-00670-1: General Purpose Transistor, PNP Silicon, 3-Pin SOT-23, Pb-Free, Tape and Reel; Manufacturer: On Semiconductor; IC Continuous (A): -0.2; fT Min (MHz): 250; PackageDescription: 3-Pin Small Outline Transistor, Body 2.92 x 1.3 mm, Pitch 0.95 mm; PartNumber: MMBT3906LT1G; Packing: Tape and Reel; ComponentLink3Description: Package Specification; Mounting Technology: Surface Mount; ComponentLink3URL: http://www.onsemi.cn/pub_link/Collateral/318-08.PDF; ComponentLink1URL: http://www.onsemi.com/; ComponentLink2URL: http://www.onsemi.cn/pub_link/Collateral/MMBT3906LT1-D.PDF; PackageReference: SOT-23-3-318-08; Polarity: PNP; ComponentLink2Description: Datasheet; PackageVersion: Rev. AP, 11/2009; RoHS: TRUE; DatasheetVersion: Rev. 11; ComponentLink1Description: Manufacturer URL
R38 = CR0603-JW-102ELF: Resistor; Manufacturer_Name: Bourns; Datasheet Link: https://www.bourns.com/pdfs/chpreztr.pdf; Height: 0.55mm; Manufacturer_Part_Number: CR0603-JW-102ELF; Mouser Part Number: 652-CR0603-JW-102ELF; Mouser Price/Stock: https://www.mouser.co.uk/ProductDetail/Bourns/CR0603-JW-102ELF?qs=rcPhh2wube3o3zlmFZCUPg%3D%3D; Arrow Part Number: CR0603-JW-102ELF; Arrow Price/Stock: https://www.arrow.com/en/products/cr0603-jw-102elf/bourns?region=nac
R39 R40 = CMP-26527-004280-1: 330Ω ±5% 0.1W 0603 Thick Film Chip Resistor AEC-Q200 compliant; Temperature Coefficient: 100ppm/°C; Power Rating: 100mW; Working Voltage: 75V; Radiation Hardening: No; Series: RMCF; Technology: THICK FILM; Construction: Rectangular; Case/Package: 0603; Contact Plating: Tin; Length: 1.55mm; Max Operating Temperature: 155°C; Military Standard: Not; Height: 0.022inch; Case Code (Imperial): 0603; Width: 0.031inch; RoHS Compliant: Yes; Tolerance: 5%; Mount: Surface Mount; Depth: 0.8mm; Case Code (Metric): 1608; Lead Free: Lead Free; Resistor Type: Thick Film; Min Operating Temperature: -55°C; Number of Terminations: 2; Packaging: Tape and Reel; Max Power Dissipation: 100mW; Features: Automotive AEC-Q200; Resistance: 330R
R41-R44 = CR0603-FX-1002ELF: Resistor; Manufacturer_Name: Bourns; Datasheet Link: https://www.bourns.com/pdfs/chpreztr.pdf; Height: 0.55mm; Manufacturer_Part_Number: CR0603-FX-1002ELF; Mouser Part Number: 652-CR0603FX-1002ELF; Mouser Price/Stock: https://www.mouser.co.uk/ProductDetail/Bourns/CR0603-FX-1002ELF?qs=K5ddiUFZPT6XHG0dQH96QA%3D%3D; Arrow Part Number: CR0603-FX-1002ELF; Arrow Price/Stock: https://www.arrow.com/en/products/cr0603-fx-1002elf/bourns?utm_currency=USD&region=europe
R45 R46 = CMP-02407-000782-1: RES SMD 100 OHM 1% 1/8W 0603; Voltage Rating: 75V; Resistance: 100kR; Power Rating: 125mW; Temperature Coefficient: 25ppm/°C; Tolerance: 0.5%; Max Power Dissipation: 150mW; Composition: Thin Film; Packaging: Tape and Reel; Max Operating Temperature: 175°C; Voltage Rating (DC): 75V; Military Standard: Not; Width: 0.033inch; Package Quantity: 1; Depth: 0.85mm; Min Operating Temperature: -55°C; Case Code (Imperial): 0603; Features: Automotive AEC-Q200; Height: 0.022inch; Number of Terminations: 2; Length: 0.061inch; REACH SVHC: No SVHC; Case Code (Metric): 1608; Case/Package: 0603

## Nets that join several sheets
GND: XBeeRadioMain (23 pins), FTDI_Chip (31 pins), Peripherals (18 pins), LED_Indicators (7 pins)
VCC_3v3: XBeeRadioMain (12 pins), FTDI_Chip (10 pins), Peripherals (14 pins), LED_Indicators (5 pins)
FTDI_1V8: FTDI_Chip (IC1.12 IC1.37 IC1.49 IC1.64), Peripherals (5 pins)
FTDI_~{RESET}: FTDI_Chip (IC1.27), Peripherals (IC2.1 R30.2)
~{RESET}: XBeeRadioMain (C7.1 MD1.6 R33.1), Peripherals (IC2.4 R32.2)
VPHY: FTDI_Chip (IC1.4), Peripherals (C25.2 C26.2 L5.2)
VPLL: FTDI_Chip (IC1.9), Peripherals (C23.2 C24.2 L4.2)
XBX DIO7/~{CTS}: XBeeRadioMain (MD1.25), FTDI_Chip (R22.2), Peripherals (J3.5)
XBX DIO13/DOUT: XBeeRadioMain (MD1.3), FTDI_Chip (R26.2), Peripherals (J3.3), LED_Indicators (R41.1)
XBX DO18/SPI CLK: XBeeRadioMain (MD1.14), FTDI_Chip (R27.2), Peripherals (J4.4)
XBX_~{DTR}/SLP_RQ/DIO8: XBeeRadioMain (MD1.10), FTDI_Chip (R24.2)
XBX_DIN/DIO14/~{CONFIG}: XBeeRadioMain (MD1.4 R4.1), FTDI_Chip (R28.2), Peripherals (J3.2), LED_Indicators (R42.1)
XBX_DIO6/~{RTS}: XBeeRadioMain (MD1.29), FTDI_Chip (R17.2), Peripherals (J3.4)
XBX_~{SATTN}/~{BM}/DIO19: XBeeRadioMain (MD1.12), FTDI_Chip (R29.2)
XBX_~{SSEL}/DIO17: XBeeRadioMain (MD1.15), FTDI_Chip (R25.2), Peripherals (J4.5)
XBX_SMISO/DIO15: XBeeRadioMain (MD1.17), FTDI_Chip (R18.2), Peripherals (J4.3)
XBX_SMOSI/DIO16: XBeeRadioMain (MD1.16), FTDI_Chip (R23.2), Peripherals (J4.2)